# Altium project motordriver-v4.0.PrjPcb
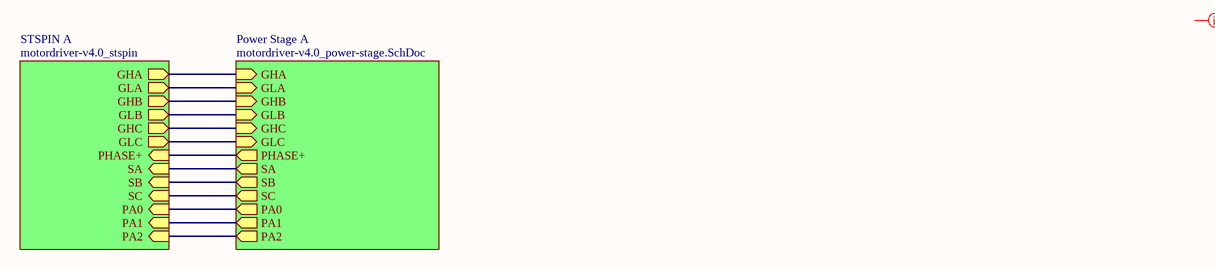
[diagram p0: motordriver-v4.0_top-level.SchDoc]
3 sheets, 71 parts. Net scope: hierarchical (ports join the sheet entries above them; power ports are global).
Board file: motordriver-v4.0.PcbDoc
Sheets:
  motordriver-v4.0_top-level.SchDoc
    Power Stage A = motordriver-v4.0_power-stage.SchDoc
    STSPIN A = motordriver-v4.0_stspin.SchDoc

## Sheet motordriver-v4.0_top-level.SchDoc
size A4; SheetNumber: 1; SheetTotal: 3

### Sub-sheets
Power Stage A = motordriver-v4.0_power-stage.SchDoc: GHA (in), GLA (in), GHB (in), GLB (in), GHC (in), GLC (in), PHASE+ (out), SA (out), SB (out), SC (out), PA0 (out), PA1 (out), PA2 (out)
STSPIN A = motordriver-v4.0_stspin: GHA (out), GLA (out), GHB (out), GLB (out), GHC (out), GLC (out), PHASE+ (in), SA (in), SB (in), SC (in), PA0 (in), PA1 (in), PA2 (in)

### Nets
GHA: sheet Power Stage A/GHA, sheet STSPIN A/GHA
GHB: sheet Power Stage A/GHB, sheet STSPIN A/GHB
GHC: sheet Power Stage A/GHC, sheet STSPIN A/GHC
GLA: sheet Power Stage A/GLA, sheet STSPIN A/GLA
GLB: sheet Power Stage A/GLB, sheet STSPIN A/GLB
GLC: sheet Power Stage A/GLC, sheet STSPIN A/GLC
PA0: sheet Power Stage A/PA0, sheet STSPIN A/PA0
PA1: sheet Power Stage A/PA1, sheet STSPIN A/PA1
PA2: sheet Power Stage A/PA2, sheet STSPIN A/PA2
SA: sheet Power Stage A/SA, sheet STSPIN A/SA
SB: sheet Power Stage A/SB, sheet STSPIN A/SB
SC: sheet Power Stage A/SC, sheet STSPIN A/SC
NetR19_2: sheet Power Stage A/PHASE+, sheet STSPIN A/PHASE+

## Sheet motordriver-v4.0_power-stage.SchDoc
size A4; SheetNumber: 2; SheetTotal: 3
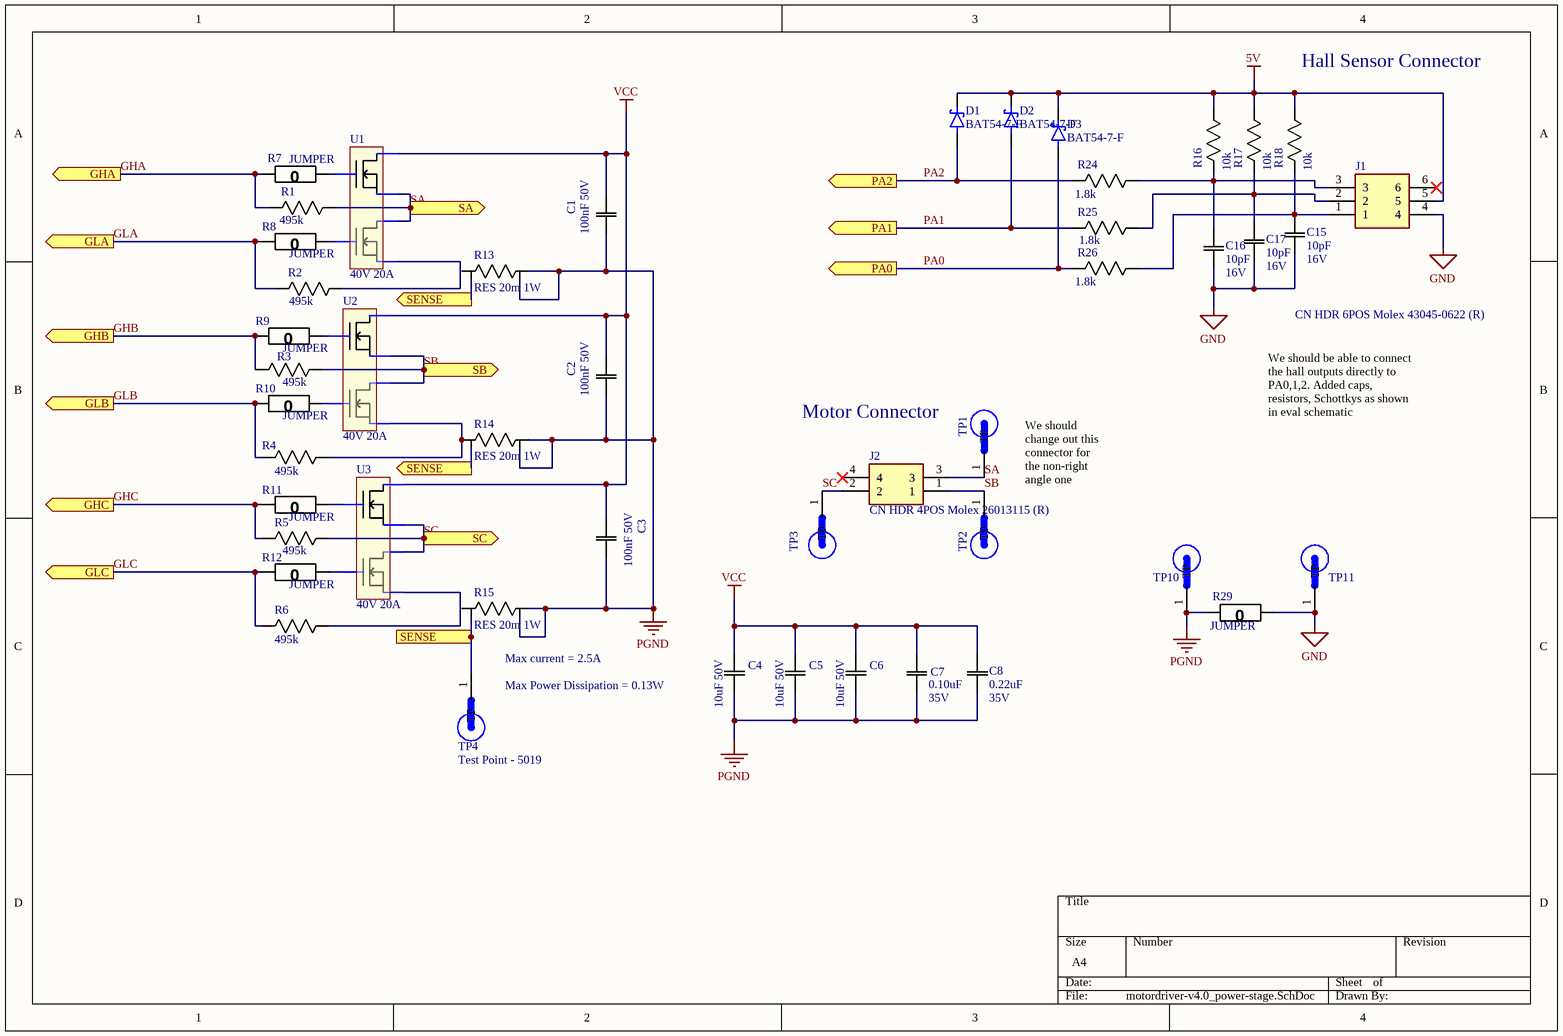
[diagram p1: motordriver-v4.0_power-stage.SchDoc]

### Parts
C1  100nF 50V  [0603]
C2  100nF 50V  [0603]
C3  100nF 50V  [0603]
C4  10uF 50V  [0805]
C5  10uF 50V  [0805]
C6  10uF 50V  [0805]
C7  Rating: 35V  [0603]  (hidden comment: 0.10uF)
C8  Rating: 35V  [0603]  (hidden comment: 0.22uF)
C15  Rating: 16V  [0603]  (hidden comment: 10pF)
C16  Rating: 16V  [0603]  (hidden comment: 10pF)
C17  Rating: 16V  [0603]  (hidden comment: 10pF)
D1  BAT54-7-F  [BAT54-7-F]
D2  BAT54-7-F  [BAT54-7-F]
D3  BAT54-7-F  [BAT54-7-F]
J1  CN HDR 6POS Molex 43045-0622 (R)  [430450622]
J2  CN HDR 4POS Molex 26013115 (R)  [26013115]
R1  495k  [0603]
R2  495k  [0603]
R3  495k  [0603]
R4  495k  [0603]
R5  495k  [0603]
R6  495k  [0603]
R7  JUMPER  [0603]
R8  JUMPER  [0603]
R9  JUMPER  [0603]
R10  JUMPER  [0603]
R11  JUMPER  [0603]
R12  JUMPER  [0603]
R13  RES 20m 1W  [1206 - Sense]
R14  RES 20m 1W  [1206 - Sense]
R15  RES 20m 1W  [1206 - Sense]
R16  10k  [0603]
R17  10k  [0603]
R18  10k  [0603]
R24  1.8k  [0603]
R25  1.8k  [0603]
R26  1.8k  [0603]
R29  JUMPER  [0603]
TP1  Test Point - 5019  [TP380X203]  (value not drawn)
TP2  Test Point - 5019  [TP380X203]  (value not drawn)
TP3  Test Point - 5019  [TP380X203]  (value not drawn)
TP4  Test Point - 5019  [TP380X203]
TP10  Test Point - 5019  [TP380X203]  (value not drawn)
TP11  Test Point - 5019  [TP380X203]  (value not drawn)
U1  40V 20A  [PowerPAK SO8 Dual]
U2  40V 20A  [PowerPAK SO8 Dual]
U3  40V 20A  [PowerPAK SO8 Dual]

### Ports
GHA (out), GHB (out), GHC (out), GLA (out), GLB (out), GLC (out), PA0 (out), PA1 (out), PA2 (out), SA (out), SB (out), SC (out), SENSE (out)

### Nets
5V: D1.3(K) D2.3(K) D3.3(K) J1.5 R16.1(R1) R17.1(R1) R18.1(R1)
GND: C15.1(C1) C16.1(C1) C17.1(C1) J1.4 R29.1(R1) TP11.1(TP)  [project net VSS]
PGND: C1.1(C1) C2.1(C1) C3.1(C1) C4.2(C2) C5.2(C2) C6.2(C2) C7.1(C1) C8.1(C1) R13.2(R2) R13.4 R14.2(R2) R14.4 R15.2(R2) R15.4 R29.2(R2) TP10.1(TP)
VCC: C1.2(C2) C2.2(C2) C3.2(C2) C4.1(C1) C5.1(C1) C6.1(C1) C7.2(C2) C8.2(C2) U1.8(D1) U2.8(D1) U3.8(D1)
GHA: R1.2(R2) R7.2(R2) ; port GHA
GHB: R3.2(R2) R9.2(R2) ; port GHB
GHC: R5.2(R2) R11.2(R2) ; port GHC
GLA: R2.2(R2) R8.2(R2) ; port GLA
GLB: R4.2(R2) R10.2(R2) ; port GLB
GLC: R6.2(R2) R12.2(R2) ; port GLC
PA0: D3.1(A) R26.2(R2) ; port PA0
PA1: D2.1(A) R25.2(R2) ; port PA1
PA2: D1.1(A) R24.2(R2) ; port PA2
SA: J2.3 R1.1(R1) TP1.1(TP) U1.1(S1) U1.6(D2) ; port SA
SB: J2.1 R3.1(R1) TP2.1(TP) U2.1(S1) U2.6(D2) ; port SB
SC: J2.2 R5.1(R1) TP3.1(TP) U3.1(S1) U3.6(D2) ; port SC
NetC15_2: C15.2(C2) J1.1 R18.2(R2) R26.1(R1)
NetC16_2: C16.2(C2) J1.3 R16.2(R2) R24.1(R1)
NetC17_2: C17.2(C2) J1.2 R17.2(R2) R25.1(R1)
NetR2_1: R2.1(R1) U1.3(S2)
NetR4_1: R4.1(R1) R14.1(R1) U2.3(S2)
NetR6_1: R6.1(R1) U3.3(S2)
NetR7_1: R7.1(R1) U1.2(G1)
NetR8_1: R8.1(R1) U1.4(G2)
NetR9_1: R9.1(R1) U2.2(G1)
NetR10_1: R10.1(R1) U2.4(G2)
NetR11_1: R11.1(R1) U3.2(G1)
NetR12_1: R12.1(R1) U3.4(G2)
NetR13_3: R13.3 R14.3 R15.3 TP4.1(TP) ; port SENSE

Not connected (* = marked no-connect by the designer): J1 6*; J2 4*; R13 1(R1); R15 1(R1)

### Notes on the sheet
- Hall Sensor Connector
- Motor Connector
- We should be able to connect the hall outputs directly to PA0,1,2. Added caps, resistors, Schottkys as shown in eval schematic
- We should change out this connector for the non-right angle one
- Max current = 2.5A
- Max Power Dissipation = 0.13W

### Library data of the parts
C1-C3 = CAP 100nF 50V: CAP CER 0.1UF 50V X7R 0805; Tolerance: 10%; Package: 0805; Value: 100nF; Rating: 50V
C4-C6 = CAP 10uF 50V: CAP CER 10UF 50V X7R; Tolerance: 10%; Package: 1210; Value: 10uF; Rating: 50V; ComponentLink1Description: digikey; ComponentLink1URL: https://www.digikey.ca/en/products/detail/kemet/C1210C106M5RACTU/4918883
C7 = CAP 0.10uF 35V: CAP CER 0.10UF 35V X7R 0603/0805; Tolerance: 10%; Package: 0603/0805; Temperature Coefficient: X7R; Operating Temperature: -55°C ~ 125°C; Value: 0.10uF
C8 = CAP 0.22uF 35V: CAP CER 0.22UF 35V X7R 0603/0805; Tolerance: 10%; Package: 0603/0805; Temperature Coefficient: X7R; Operating Temperature: -55°C ~ 125°C; Value: 0.22uF
C15-C17 = CAP 10pF 16V: CAP CER 10PF 16V X5R 0603; Tolerance: 10%; Package: 0603; Temperature Coefficient: X5R; Operating Temperature: -55°C ~ 85°C; Value: 10pF
D1-D3 = DIODE SCHOTTKY BAT54-7-F: DIODE SCHOTTKY 30V 200MA SOT23-3; Manufacturer: Diodes Incorporated; VDC Reverse: 30 V; Digikey Link: https://www.digikey.ca/en/products/detail/diodes-incorporated/BAT54-7-F/717699; Digikey PN: BAT54-FDICT-ND
J1 = CN HDR 6POS Molex 43045-0622 (R): Molex 43045-0622 6POS Microfit / dual row, right angle
J2 = CN HDR 4POS Molex 26013115 (R): Molex 26013115 4POS Minifit / dual row, right angle
R1-R6 = RES 495k 1/8W: RES SMD 499K OHM 1% 1/8W 0805; Manufacturer: Yageo; Manufacturer Part Number: RC0805FR-07499KL; Temperature Coefficient: 100ppm/°C; Voltage Rating (DC): 150V; Resistance: 499kR; Power Rating: 125mW; Supplier 1: Digi-Key; RoHS: Yes; Category: Chip SMD Resistors; Stock 1: 2275; Pricing 1: 1=0.10000, 10=0.04000, 100=0.01630, 1000=0.00731, 2500=0.00635 (USD); Case/Package: 0805; Case Code (Metric): 2012; Case Code (Imperial): 0805; Contact Plating: Tin,Lead,Matte; Min Operating Temperature: -55°C; Max Operating Temperature: 155°C; Termination: SMD/SMT; Composition: Thick Film; Military Standard: Not; Tolerance: 1%; Voltage Rating: 150V; Packaging: Tape and Reel; Length: 2mm; Depth: 1.25mm; Radiation Hardening: No; Lead Free: Lead Free; ComponentLink1URL: https://datasheet.ciiva.com/15189/getdatasheetpartid-326570-15189975.pdf?src-supplier=Verical; ComponentLink1Description: https://datasheet.ciiva.com/15189/getdatasheetpartid-326570-15189975.pdf?src-supplier=Verical; Supplier Part Number 1: 311-499KCRCT-ND
R7-R12 R29 = RES 0 JUMPER: RES SMD 0 OHM JUMPER GENERIC 0805; Value: 0; Package: 0805
R13-R15 = RES 20m 1W: RES SMD 0.02 OHM 1% 1W 1206
R16-R18 = RES 10k 1/8W - 1%: RES SMD 10K OHM 1% 1/8W 0805; Power (Watts): 0.125W; Package: 0805; Value: 10k; Tolerance: 1%
R24-R26 = RES 1.8k 1/8W: RES SMD 1.8K OHM 5% 1/8W 0805; Power (Watts): 0.125W; Package: 0805; Value: 1.8k; Tolerance: 5%
TP1-TP4 TP10 TP11 = Test Point - 5019: PC Test Point, Miniature Phosphor Bronze, Silver Plating Surface Mount Mounting Type; MP: 5019; MF: Keystone Electronics; Value: *; Package: 2010 Keystone; Digi-Key_Part_Number: 36-5019CT-ND; Digi-Key_Purchase_URL: https://www.digikey.com/product-detail/en/keystone-electronics/5019/36-5019CT-ND/3907344?utm_source=snapeda&utm_medium=aggregator&utm_campaign=symbol
U1-U3 = MOSFET N-CH DUAL 40V 20A: MOSFET N+N 40V 20A; MF: Vishay Siliconix; MF P/N: Si7288DP; Supplier 1: Digi-Key; Supplier Part Number 1: SI7288DP-T1-GE3CT-ND

## Sheet motordriver-v4.0_stspin.SchDoc
size A4; SheetNumber: 3; SheetTotal: 3
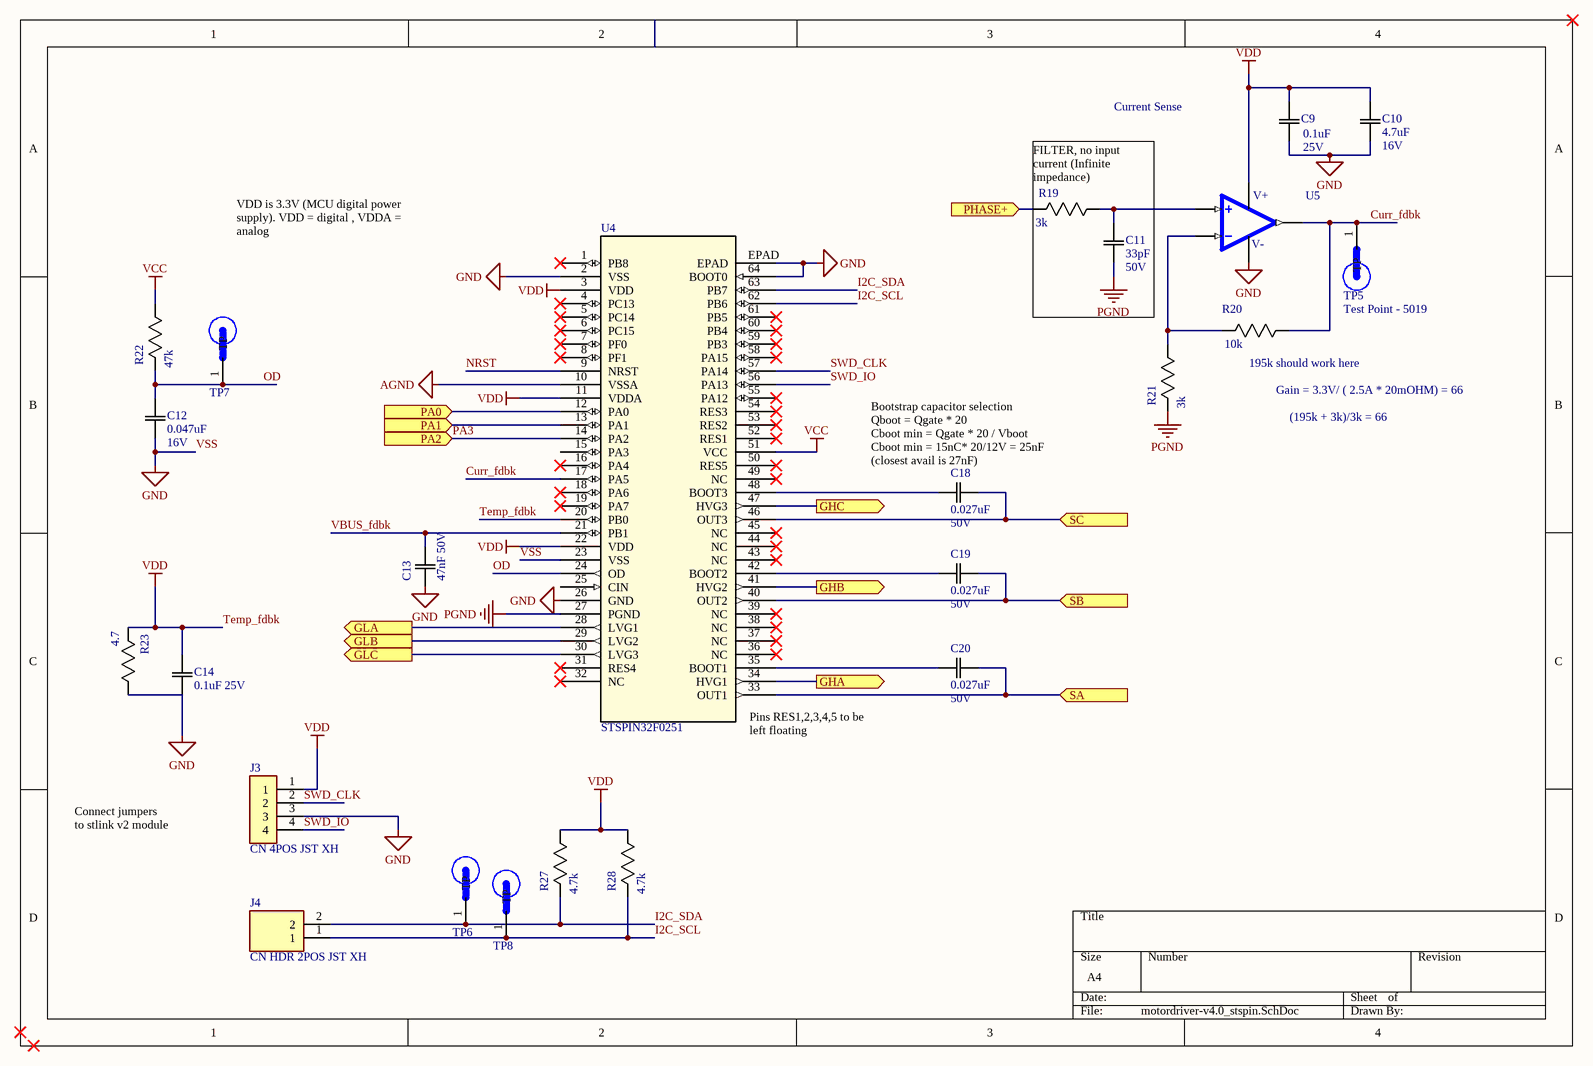
[diagram p2: motordriver-v4.0_stspin.SchDoc]

### Parts
C9  value 0.1uF  Rating: 25V  [0805]  (hidden comment: 0.1uF 25V)
C10  Rating: 16V  [0603]  (hidden comment: 4.7uF)
C11  Rating: 50V  [0603]  (hidden comment: 33pF)
C12  Rating: 16V  [0603]  (hidden comment: 0.047uF)
C13  47nF 50V  [0805]
C14  0.1uF 25V  [0805]
C18  0.027uF  Rating: 50V  [0805]
C19  0.027uF  Rating: 50V  [0805]
C20  0.027uF  Rating: 50V  [0805]
J3  CN 4POS JST XH  [JST_B4B-XH-A(LF)(SN)]
J4  CN HDR 2POS JST XH  [JST_B2B-XH-A(LF)(SN)]
R19  3k  [0805]
R20  10k  [0805]
R21  3k  [0805]
R22  47k  [0805]
R23  4.7  [0805]
R27  4.7k  [0805]
R28  4.7k  [0805]
TP5  Test Point - 5019  [TP380X203]
TP6  Test Point - 5019  [TP380X203]  (value not drawn)
TP7  Test Point - 5019  [TP380X203]  (value not drawn)
TP8  Test Point - 5019  [TP380X203]  (value not drawn)
U4  STSPIN32F0251  [STSPIN32F0251TR]
U5  OP AMP TSV911ILT  [TSV911ILT Opamp]  (value not drawn)

### Ports
GHA (out), GHB (out), GHC (out), GLA (out), GLB (out), GLC (out), PA0 (in), PA1 (in), PA2 (in), PHASE+ (in), SA (in), SB (in), SC (in)

### Nets
AGND: U4.10(VSSA)
PGND: C11.1(C1) R21.2(R2) U4.27(PGND)
Temp_fdbk: C9.2(C2) C10.2(C2) C14.2(C2) J3.1 R23.2(R2) R27.1(R1) R28.1(R1) U4.3(VDD) U4.11(VDDA) U4.20(PB0) U4.22(VDD) U5.5(V+)  [also labelled VDD]
VCC: R22.1(R1) U4.51(VCC)
VSS: C9.1(C1) C10.1(C1) C12.1(C1) C13.1(C1) C14.1(C1) J3.3 R23.1(R1) U4.2(VSS) U4.23(VSS) U4.26(GND) U4.64(BOOT0) U4.EPAD U5.2(V-)  [also labelled GND]
Curr_fdbk: R20.1(R1) TP5.1(TP) U4.17(PA5) U5.1(OUT)
GHA: U4.34(HVG1) ; port GHA
GHB: U4.41(HVG2) ; port GHB
GHC: U4.47(HVG3) ; port GHC
GLA: U4.28(LVG1) ; port GLA
GLB: U4.29(LVG2) ; port GLB
GLC: U4.30(LVG3) ; port GLC
I2C_SCL: J4.1 R28.2(R2) TP8.1(TP) U4.62(PB6)
I2C_SDA: J4.2 R27.2(R2) TP6.1(TP) U4.63(PB7)
NRST: U4.9(NRST)
OD: C12.2(C2) R22.2(R2) TP7.1(TP) U4.24(OD)
PA0: U4.12(PA0) ; port PA0
PA1: U4.13(PA1) ; port PA1
PA3: U4.14(PA2) ; port PA2  [project net PA2]
SA: C20.2 U4.33(OUT1) ; port SA
SB: C19.2 U4.40(OUT2) ; port SB
SC: C18.2 U4.46(OUT3) ; port SC
SWD_CLK: J3.2 U4.57(PA14)
SWD_IO: J3.4 U4.56(PA13)
VBUS_fdbk: C13.2(C2) U4.21(PB1)
NetC11_2: C11.2(C2) R19.1(R1) U5.3(IN+)
NetC18_1: C18.1 U4.48(BOOT3)
NetC19_1: C19.1 U4.42(BOOT2)
NetC20_1: C20.1 U4.35(BOOT1)
NetR19_2: R19.2(R2) ; port PHASE+
NetR20_2: R20.2(R2) R21.1(R1) U5.4(IN-)

Not connected (* = marked no-connect by the designer): U4 1(PB8)* 4(PC13)* 5(PC14)* 6(PC15)* 7(PF0)* 8(PF1)* 15(PA3) 16(PA4)* 18(PA6)* 19(PA7)* 25(CIN) 31(RES4)* 32(NC)* 36(NC)* 37(NC)* 38(NC)* 39(NC)* 43(NC)* 44(NC)* 45(NC)* 49(NC)* 50(RES5)* 52(RES1)* 53(RES2)* 54(RES3)* 55(PA12)* 58(PA15)* 59(PB3)* 60(PB4)* 61(PB5)*

### Notes on the sheet
- Current Sense
- VDD is 3.3V (MCU digital power supply). VDD = digital , VDDA = analog
- FILTER, no input current (Infinite impedance)
- (near R20) 195k should work here
- Gain = 3.3V/ ( 2.5A * 20mOHM) = 66
- (near C18) Bootstrap capacitor selection
  Qboot = Qgate * 20
  Cboot min = Qgate * 20 / Vboot
  Cboot min = 15nC* 20/12V = 25nF (closest avail is 27nF)
- (195k + 3k)/3k = 66
- (near U4) Pins RES1,2,3,4,5 to be left floating
- Connect jumpers to stlink v2 module

### Library data of the parts
C9 C14 = CAP 0.1uF 25V: CAP CER 0.1UF 25V X7R 0805; Tolerance: 10%; Temperature Coefficient: X7R; Operating Temperature: -55°C ~ 125°C
  C14: Value: 0.1uF; Rating: 25V
C10 = CAP 4.7uF 16V: CAP CER 4.7UF 16V X5R 0603/0805; Tolerance: 10%; Package: 0603/0805; Temperature Coefficient: X5R; Operating Temperature: -55°C ~ 85°C; Value: 4.7uF
C11 = CAP 33pF 50V: CAP CER 33PF 50V X7R 0603/0805; Tolerance: 10%; Package: 0603/0805; Temperature Coefficient: X7R; Operating Temperature: -55°C ~ 125°C; Value: 33pF
C12 = CAP 0.047uF 16V: CAP CER 0.047UF 16V X5R 0603/0805; Tolerance: 10%; Package: 0603/0805; Temperature Coefficient: X5R; Operating Temperature: -55°C ~ 85°C; Value: 0.047uF
C13 = CAP 47nF 50V: CAP CER 0.047UF 50V X7R 0805; Tolerance: 5%; Package: 0805; Value: 47nF; Rating: 50V; Alt. Value: 47nF
C18-C20 = CAP 0.027UF 50V X7R 0805: CAP CER 0.027UF 50V X7R 0805; Tolerance: 5%; Package: 0805; Temperature Coefficient: X7R; Operating Temperature: -55°C ~ 125°C; Value: 0.027uF
J3 = CN 4POS JST XH: Connector Header Through Hole 4 position 0.098 _2.50mm_ / B4B-XH-A(LF)(SN); MP: B4B-XH-A_LF__SN_; MF: JST Sales; Price: None; Package: None; Value: *; Availability: Unavailable; SnapEDA_Link: https://www.snapeda.com/parts/B4B-XH-A%28LF%29%28SN%29/JST%20Sales%20America%20Inc./view-part/447494/?ref=snap
J4 = CN HDR 2POS JST XH: Connector Header Through Hole 2 position 0.098 _2.50mm_ / JST XH; MP: B2B-XH-A_LF__SN_; MF: JST Sales; Price: None; Package: None; Value: *; Availability: Unavailable; SnapEDA_Link: https://www.snapeda.com/parts/B2B-XH-A%28LF%29%28SN%29/JST%20Sales%20America%20Inc./view-part/492310/?ref=snap
R19 R21 = RES 3k 1/8W: RES SMD 3K OHM 5% 1/8W 0805; Power (Watts): 0.125W; Package: 0805; Value: 3k; Tolerance: 5%
R20 = RES 10k 1/8W - 5%: RES SMD 10K OHM 5% 1/8W 0805; Power (Watts): 0.125W; Package: 0805; Value: 10k; Tolerance: 5%
R22 = RES 47k 1/8W - 5%: RES SMD 47k OHM 5% 1/8W 0805; Power (Watts): 0.125W; Package: 0805; Value: 47k; Tolerance: 5%
R23 = RES 4.7 1/8W: RES SMD 4.7 OHM 5% 1/8W 0805; Power (Watts): 0.125W; Package: 0805; Value: 4.7; Tolerance: 5%
R27 R28 = RES 4.7k 1/8W - 1%: RES SMD 4.7k OHM 1% 1/8W 0805; Power (Watts): 0.125W; Package: 0805; Value: 4.7k; Tolerance: 1%
TP5-TP8 = Test Point - 5019: as TP1 on sheet motordriver-v4.0_power-stage; Value: *; Package: 2010 Keystone; Digi-Key_Part_Number: 36-5019CT-ND; Digi-Key_Purchase_URL: https://www.digikey.com/product-detail/en/keystone-electronics/5019/36-5019CT-ND/3907344?utm_source=snapeda&utm_medium=aggregator&utm_campaign=symbol
U4 = STSPIN32F0251: 250 V BLDC THREE-PHASE CONTROLLER; Manufacturer: STMicroelectronics; V rating: 9V ~ 20V; Digikey Link: https://www.digikey.ca/en/products/detail/stmicroelectronics/STSPIN32F0251TR/11591126; Digikey PN: 497-STSPIN32F0251CT-ND; Manufacturer PN: STSPIN32F0251TR; Package: 64-TQFP Exposed Pad
U5 = OP AMP TSV911ILT: IC OPAMP GP 1 CIRCUIT SOT23-5; Manufacturer: STMicroelectronics; DK PN: 497-6000-1-ND; Vsupply: 2.5V ~ 5.5V; DK Link: https://www.digikey.ca/en/products/detail/stmicroelectronics/TSV911ILT/1578404; Manu PN: TSV911ILT

## Nets that join several sheets
PGND: motordriver-v4.0_power-stage (16 pins), motordriver-v4.0_stspin (C11.1 R21.2 U4.27)
VCC: motordriver-v4.0_power-stage (11 pins), motordriver-v4.0_stspin (R22.1 U4.51)
VSS: motordriver-v4.0_power-stage (6 pins), motordriver-v4.0_stspin (13 pins)
GHA: motordriver-v4.0_power-stage (R1.2 R7.2), motordriver-v4.0_stspin (U4.34)
GHB: motordriver-v4.0_power-stage (R3.2 R9.2), motordriver-v4.0_stspin (U4.41)
GHC: motordriver-v4.0_power-stage (R5.2 R11.2), motordriver-v4.0_stspin (U4.47)
GLA: motordriver-v4.0_power-stage (R2.2 R8.2), motordriver-v4.0_stspin (U4.28)
GLB: motordriver-v4.0_power-stage (R4.2 R10.2), motordriver-v4.0_stspin (U4.29)
GLC: motordriver-v4.0_power-stage (R6.2 R12.2), motordriver-v4.0_stspin (U4.30)
PA0: motordriver-v4.0_power-stage (D3.1 R26.2), motordriver-v4.0_stspin (U4.12)
PA1: motordriver-v4.0_power-stage (D2.1 R25.2), motordriver-v4.0_stspin (U4.13)
PA2: motordriver-v4.0_power-stage (D1.1 R24.2), motordriver-v4.0_stspin (U4.14)
SA: motordriver-v4.0_power-stage (5 pins), motordriver-v4.0_stspin (C20.2 U4.33)
SB: motordriver-v4.0_power-stage (5 pins), motordriver-v4.0_stspin (C19.2 U4.40)
SC: motordriver-v4.0_power-stage (5 pins), motordriver-v4.0_stspin (C18.2 U4.46)